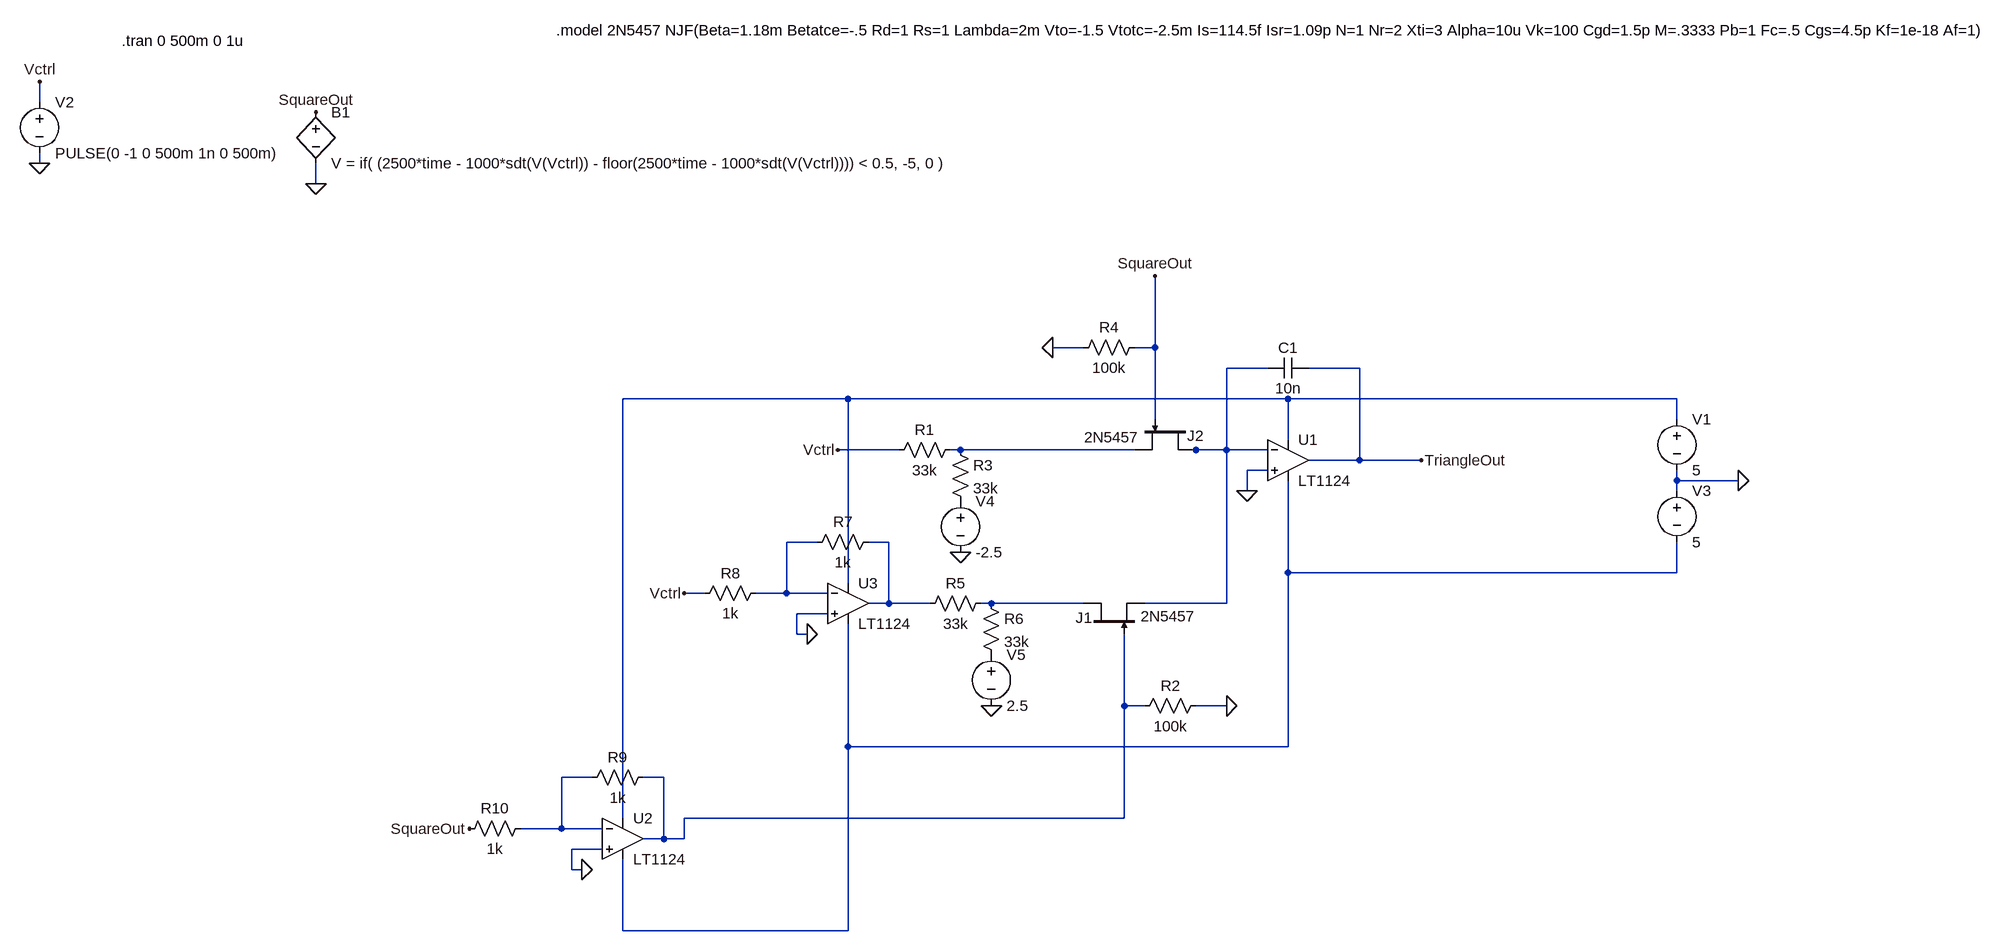
[diagram p0: schematic vco triangle.asc]
vco triangle.asc, the LTspice schematic file:
Version 4.1
SHEET 1 1476 836
WIRE -1824 -464 -1824 -496
WIRE -1824 -368 -1824 -384
WIRE -1392 -336 -1392 -368
WIRE -192 -80 -240 -80
WIRE -80 -80 -80 -192
WIRE -80 -80 -112 -80
WIRE 96 -48 32 -48
WIRE 240 -48 160 -48
WIRE -560 0 -912 0
WIRE 128 0 -560 0
WIRE 736 0 128 0
WIRE -80 32 -80 -80
WIRE 736 32 736 0
WIRE 128 64 128 0
WIRE -480 80 -576 80
WIRE -384 80 -400 80
WIRE -112 80 -384 80
WIRE -16 80 -32 80
WIRE 32 80 32 -48
WIRE 32 80 -16 80
WIRE 96 80 32 80
WIRE 240 96 240 -48
WIRE 240 96 160 96
WIRE 336 96 240 96
WIRE 96 112 64 112
WIRE 736 128 736 112
WIRE 832 128 736 128
WIRE 64 144 64 112
WIRE 736 144 736 128
WIRE -608 224 -656 224
WIRE -496 224 -528 224
WIRE 128 272 128 128
WIRE 736 272 736 224
WIRE 736 272 128 272
WIRE -560 288 -560 0
WIRE -784 304 -816 304
WIRE -656 304 -656 224
WIRE -656 304 -704 304
WIRE -592 304 -656 304
WIRE -496 320 -496 224
WIRE -496 320 -528 320
WIRE -432 320 -496 320
WIRE -336 320 -352 320
WIRE -192 320 -336 320
WIRE 32 320 32 80
WIRE 32 320 -96 320
WIRE -592 336 -640 336
WIRE -640 368 -640 336
WIRE -624 368 -640 368
WIRE -128 480 -128 368
WIRE -96 480 -128 480
WIRE 32 480 -16 480
WIRE -560 544 -560 352
WIRE 128 544 128 272
WIRE 128 544 -560 544
WIRE -960 592 -1008 592
WIRE -848 592 -880 592
WIRE -912 656 -912 0
WIRE -128 656 -128 480
WIRE -128 656 -816 656
WIRE -1008 672 -1008 592
WIRE -1008 672 -1072 672
WIRE -944 672 -1008 672
WIRE -848 688 -848 592
WIRE -848 688 -880 688
WIRE -816 688 -816 656
WIRE -816 688 -848 688
WIRE -944 704 -992 704
WIRE -992 736 -992 704
WIRE -976 736 -992 736
WIRE -912 832 -912 720
WIRE -560 832 -560 544
WIRE -560 832 -912 832
FLAG -1824 -368 0
FLAG -1392 -336 0
FLAG -1824 -496 Vctrl
FLAG 336 96 TriangleOut
FLAG -1392 -448 SquareOut
FLAG -576 80 Vctrl
FLAG 832 128 0
FLAG 32 480 0
FLAG -1152 672 SquareOut
FLAG 64 144 0
FLAG -384 240 0
FLAG -240 -80 0
FLAG -80 -192 SquareOut
FLAG -624 368 0
FLAG -336 480 0
FLAG -816 304 Vctrl
FLAG -976 736 0
SYMBOL OpAmps\\LT1124 128 32 R0
SYMATTR InstName U1
SYMBOL voltage -1824 -480 R0
WINDOW 123 0 0 Left 0
WINDOW 39 0 0 Left 0
SYMATTR InstName V2
SYMATTR Value PULSE(0 -1 0 500m 1n 0 500m)
SYMBOL bv -1392 -464 R0
SYMATTR InstName B1
SYMATTR Value V = if( (2500*time - 1000*sdt(V(Vctrl)) - floor(2500*time - 1000*sdt(V(Vctrl)))) < 0.5, -5, 0 )
SYMBOL res -384 64 R90
WINDOW 0 0 56 VBottom 2
WINDOW 3 32 56 VTop 2
SYMATTR InstName R1
SYMATTR Value 33k
SYMBOL cap 160 -64 R90
WINDOW 0 0 32 VBottom 2
WINDOW 3 32 32 VTop 2
SYMATTR InstName C1
SYMATTR Value 10n
SYMBOL voltage 736 16 R0
WINDOW 123 0 0 Left 0
WINDOW 39 0 0 Left 0
SYMATTR InstName V1
SYMATTR Value 5
SYMBOL voltage 736 128 R0
WINDOW 123 0 0 Left 0
WINDOW 39 0 0 Left 0
SYMATTR InstName V3
SYMATTR Value 5
SYMBOL njf -192 368 R270
WINDOW 0 26 -12 VRight 2
WINDOW 3 28 90 VRight 2
SYMATTR InstName J1
SYMATTR Value 2N5457
SYMBOL res -112 496 R270
WINDOW 0 32 56 VTop 2
WINDOW 3 0 56 VBottom 2
SYMATTR InstName R2
SYMATTR Value 100k
SYMBOL res -400 64 R0
SYMATTR InstName R3
SYMATTR Value 33k
SYMBOL voltage -384 144 R0
WINDOW 123 0 0 Left 0
WINDOW 39 0 0 Left 0
SYMATTR InstName V4
SYMATTR Value -2.5
SYMBOL njf -16 32 R90
WINDOW 0 26 -12 VRight 2
WINDOW 3 28 90 VRight 2
SYMATTR InstName J2
SYMATTR Value 2N5457
SYMBOL res -96 -96 R90
WINDOW 0 0 56 VBottom 2
WINDOW 3 32 56 VTop 2
SYMATTR InstName R4
SYMATTR Value 100k
SYMBOL OpAmps\\LT1124 -560 256 R0
SYMATTR InstName U3
SYMBOL res -336 304 R90
WINDOW 0 0 56 VBottom 2
WINDOW 3 32 56 VTop 2
SYMATTR InstName R5
SYMATTR Value 33k
SYMBOL res -352 304 R0
SYMATTR InstName R6
SYMATTR Value 33k
SYMBOL voltage -336 384 R0
WINDOW 123 0 0 Left 0
WINDOW 39 0 0 Left 0
SYMATTR InstName V5
SYMATTR Value 2.5
SYMBOL res -512 208 R90
WINDOW 0 0 56 VBottom 2
WINDOW 3 32 56 VTop 2
SYMATTR InstName R7
SYMATTR Value 1k
SYMBOL res -688 288 R90
WINDOW 0 0 56 VBottom 2
WINDOW 3 32 56 VTop 2
SYMATTR InstName R8
SYMATTR Value 1k
SYMBOL OpAmps\\LT1124 -912 624 R0
SYMATTR InstName U2
SYMBOL res -864 576 R90
WINDOW 0 0 56 VBottom 2
WINDOW 3 32 56 VTop 2
SYMATTR InstName R9
SYMATTR Value 1k
SYMBOL res -1056 656 R90
WINDOW 0 0 56 VBottom 2
WINDOW 3 32 56 VTop 2
SYMATTR InstName R10
SYMATTR Value 1k
TEXT -1696 -560 Left 2 !.tran 0 500m 0 1u
TEXT -1016 -576 Left 2 !.model 2N5457 NJF(Beta=1.18m Betatce=-.5 Rd=1 Rs=1 Lambda=2m Vto=-1.5 Vtotc=-2.5m Is=114.5f Isr=1.09p N=1 Nr=2 Xti=3 Alpha=10u Vk=100 Cgd=1.5p M=.3333 Pb=1 Fc=.5 Cgs=4.5p Kf=1e-18 Af=1)

The netlist it stands for:
* vco triangle.asc
X§U1 0 N001 N002 N006 TriangleOut LT1124  ; pins In+ In- V+ V- OUT
V2 Vctrl 0 PULSE(0 -1 0 500m 1n 0 500m)
B1 SquareOut 0 V = if( (2500*time - 1000*sdt(V(Vctrl)) - floor(2500*time - 1000*sdt(V(Vctrl)))) < 0.5, -5, 0 )
R1 N003 Vctrl 33k
C1 TriangleOut N001 10n
V1 N002 0 5
V3 0 N006 5
J1 N007 N008 N001 2N5457
R2 N008 0 100k
R3 N003 P001 33k
V4 P001 0 -2.5
J2 N001 SquareOut N003 2N5457
R4 SquareOut 0 100k
X§U3 0 N004 N002 N006 N005 LT1124  ; pins In+ In- V+ V- OUT
R5 N007 N005 33k
R6 N007 P002 33k
V5 P002 0 2.5
R7 N005 N004 1k
R8 N004 Vctrl 1k
X§U2 0 N009 N002 N006 N008 LT1124  ; pins In+ In- V+ V- OUT
R9 N008 N009 1k
R10 N009 SquareOut 1k
.model NJF NJF
.model PJF PJF
.lib standard.jft
.tran 0 500m 0 1u
.model 2N5457 NJF(Beta=1.18m Betatce=-.5 Rd=1 Rs=1 Lambda=2m Vto=-1.5 Vtotc=-2.5m Is=114.5f Isr=1.09p N=1 Nr=2 Xti=3 Alpha=10u Vk=100 Cgd=1.5p M=.3333 Pb=1 Fc=.5 Cgs=4.5p Kf=1e-18 Af=1)
.lib LTC.lib
.backanno
.end